# Altium project Receive_Project.PrjPcb
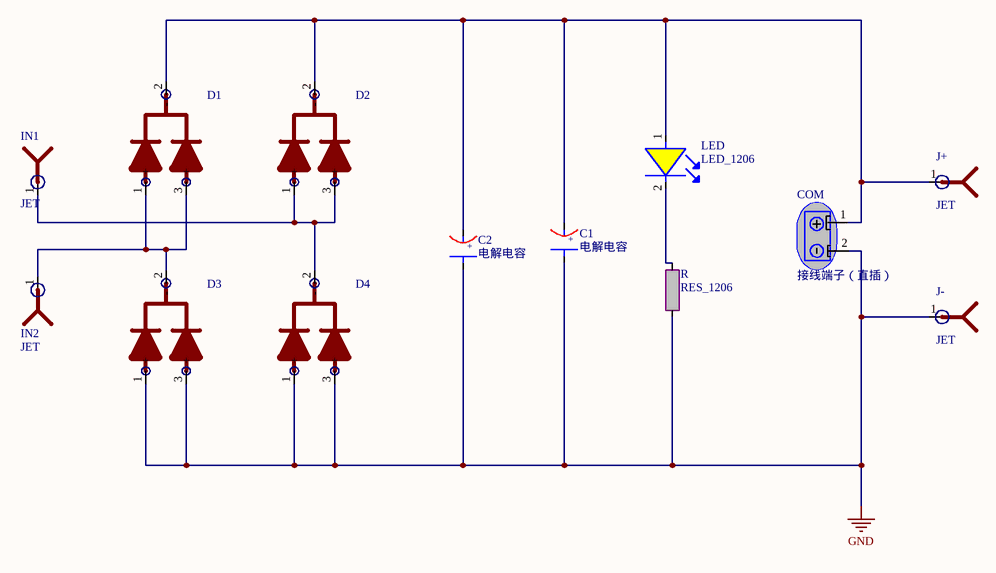
[diagram p0: Sheet1.SchDoc]
1 sheet, 13 parts. Net scope: global (net labels, ports and power ports of the same name join across sheets).
Board file: PCB1.PcbDoc

## Sheet Sheet1.SchDoc
size A4

### Parts
C1  电解电容  [电解电容直插]
C2  电解电容  [电解电容直插]
COM  接线端子（直插）  [接线端子直插]
D1  肖特基二极管  [TO-220(带散热片)]  (value not drawn)
D2  肖特基二极管  [TO-220(带散热片)]  (value not drawn)
D3  肖特基二极管  [TO-220(带散热片)]  (value not drawn)
D4  肖特基二极管  [TO-220(带散热片)]  (value not drawn)
IN1  JET  [JET]
IN2  JET  [JET]
J+  JET  [JET]
J-  JET  [JET]
LED  LED_1206  [LED_1206]
R  RES_1206  [1206_R]

### Nets
GND: C1.2 C2.2 COM.2(GND) D3.1(+) D3.3(+) D4.1(+) D4.3(+) J-.1 R.1
NetC1_1: C1.1 C2.1 COM.1(VCC) D1.2(-) D2.2(-) J+.1 LED.1
NetD1_1: D1.1(+) D1.3(+) D3.2(-) IN2.1
NetD2_1: D2.1(+) D2.3(+) D4.2(-) IN1.1
NetLED_2: LED.2 R.2

### Notes on the sheet
- (in symbol 电解电容) +